# EAGLE design ldt1 (EAGLE 5.07)
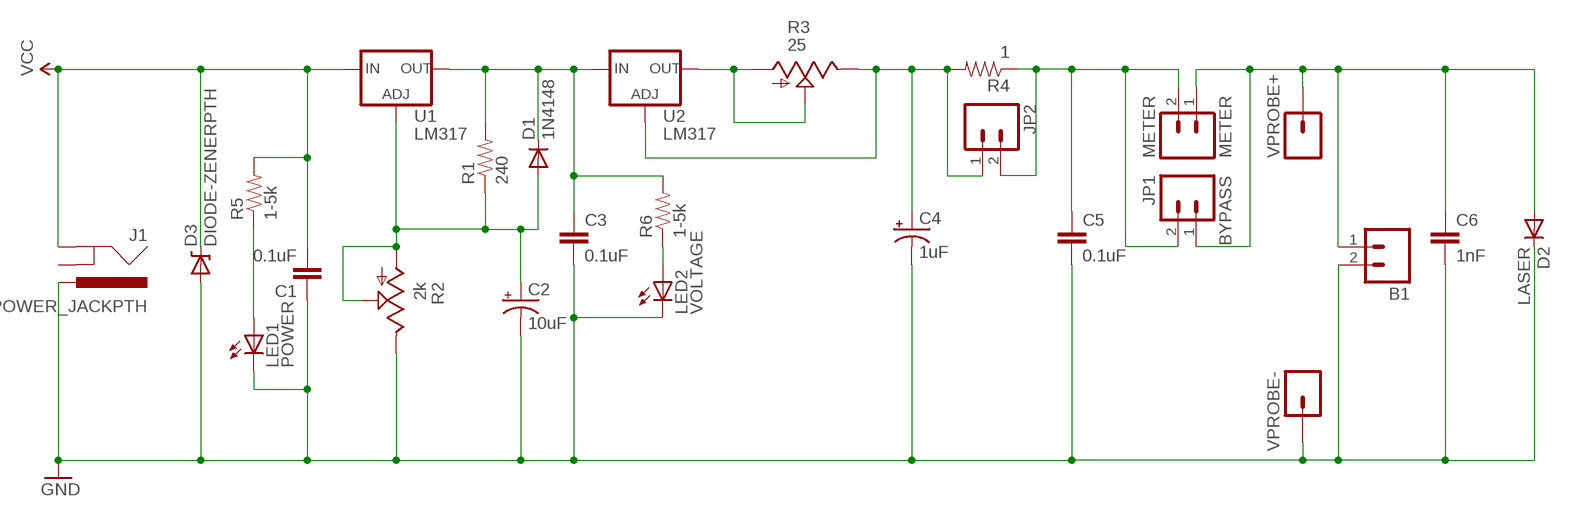
[diagram p0: schematic, sheet 1]

## Parts
B1  M02LOCK  [1X02_LOCK]
C1  0.1uF  CAPPTH2  [CAP-PTH-SMALL2]
C2  10uF  CAP_POLPTH2  [CPOL-RADIAL-10UF-25V]
C3  0.1uF  CAPPTH2  [CAP-PTH-SMALL2]
C4  1uF  CAP_POLPTH2  [CPOL-RADIAL-10UF-25V]
C5  0.1uF  CAPPTH2  [CAP-PTH-SMALL2]
C6  1nF  CAPPTH2  [CAP-PTH-SMALL2]
D1  1N4148  DIODE1N4148  [DIODE-1N4148]
D2  LASER  DIODE1N4148  [DIODE-1N4148]
D3  DIODE-ZENERPTH  [DIODE-ZENER]
J1  POWER_JACKPTH  [POWER_JACK_PTH]
JP1  BYPASS  M02LOCK  [1X02_LOCK]
JP2  M02LOCK  [1X02_LOCK]
LED1  POWER  LED3MM  [LED3MM]
LED2  VOLTAGE  LED3MM  [LED3MM]
METER  METER  M02LOCK  [1X02_LOCK]
R1  240  RESISTORPTH1  [AXIAL-0.3]
R2  2k  TRIM_US-S75P  [S75P]
R3  25  TRIM_US-S75P  [S75P]
R4  1  RESISTORPTH1  [AXIAL-0.3]
R5  1-5k  RESISTORPTH1  [AXIAL-0.3]
R6  1-5k  RESISTORPTH1  [AXIAL-0.3]
U1  LM317  V_REG_317SINK  [TO220-ADJ]
U2  LM317  V_REG_317SINK  [TO220-ADJ]
VPROBE+  M01OFFSET  [1X01_OFFSET]
VPROBE-  M01OFFSET  [1X01_OFFSET]

## Nets
GND: B1.2 C1.1 C2.2(-) C3.2 C4.2(-) C5.2 C6.2 D2.C D3.P$2(A) J1.PWR LED1.K(C) LED2.K(C) R2.E VPROBE-.1
N$1: C3.1 D1.C R1.P$2 R6.P$2 U1.OUT U2.IN
N$2: C2.1(+) D1.A R1.P$1 R2.A R2.S U1.ADJ
N$3: R3.A R3.S U2.OUT
N$4: LED1.A R5.P$1
N$5: C4.1(+) JP2.1 R3.E R4.P$2 U2.ADJ
N$6: LED2.A R6.P$1
N$7: B1.1 C6.1 D2.A JP1.1 METER.1 VPROBE+.1
N$9: C5.1 JP1.2 JP2.2 METER.2 R4.P$1
VCC: C1.2 D3.P$1(C) J1.GND R5.P$2 U1.IN
Unconnected: J1.GNDBREAK

## Library data of the parts
B1 JP1 JP2 METER = SparkFun:M02: Header 2 Standard 2-pin 0.1" header. Use with straight break away headers (SKU : PRT-00116), right angle break away headers (PRT-00553), swiss pins (PRT-00743), machine pins (PRT-00117), and female headers (PRT-00115). Molex polarized connector foot print use with SKU : PRT-08233 with associated crimp pins and housings.
C1 C3 C5 C6 = SparkFun:CAP: Capacitor Standard 0603 ceramic capacitor, and 0.1" leaded capacitor.
C2 C4 = SparkFun:CAP_POL: Capacitor Polarized These are standard SMD and PTH capacitors. Normally 10uF, 47uF, and 100uF in electrolytic and tantalum varieties. Always verify the external diameter of the through hole cap, it varies with capacity, voltage, and manufacturer. The EIA devices should be standard.
D1 D2 = SparkFun:DIODE: Diode These are standard reverse protection diodes and small signal diodes. SMA package can handle up to about 1A. SOD-323 can handle about 200mA. What the SOD-323 package when ordering, there are some mfgs out there that are 5-pin packages.
D3 = SparkFun:DIODE-ZENER: Zener Diode Production Part - 8199 3.4V Zener Voltage
J1 = SparkFun:POWER_JACK: Power Jack This is the standard 5.5mm barrel jack for power. The PTH is the most common, proven, reliable, footprint. All others are experimental. The Slot footprint only works if the mill layer is transmitted to the PCB fab house so be warned. Spark Fun Electronics SKU : PRT-00119. Mating wall wart : TOL-00298 (and others)
LED1 LED2 = SparkFun:LED: LEDs Standard schematic elements and footprints for 5mm, 3mm, 1206, and 0603 sized LEDs. 5mm - Spark Fun Electronics SKU : COM-00529 (and others)
R1 R4-R6 = SparkFun:RESISTOR: Resistor Basic schematic elements and footprints for 0603, 1206, and PTH 1/10th watt (small) resistors.
R2 R3 = pot:TRIM_US-: POTENTIOMETER
U1 U2 = SparkFun:V_REG_317: Voltage Regulator Standard LM317 adjustable voltage regulator. AOI (Adjust Output Input). Google 'LM317 Calculator' for easy to use app to get the two resistor values needed. 240/720 for 5V output. 240/390 for 3.3V output. Spark Fun Electronics SKU : COM-00527
VPROBE+ VPROBE- = SparkFun:M01: Header 1 Standard 1-pin 0.1" header. Use with straight break away headers (SKU : PRT-00116), right angle break away headers (PRT-00553), swiss pins (PRT-00743), machine pins (PRT-00117), and female headers (PRT-00115).

## Net classes
0 default: width 1.27 mm, clearance 0.381 mm
1 power: width 1.27 mm, clearance 0.381 mm

## Board
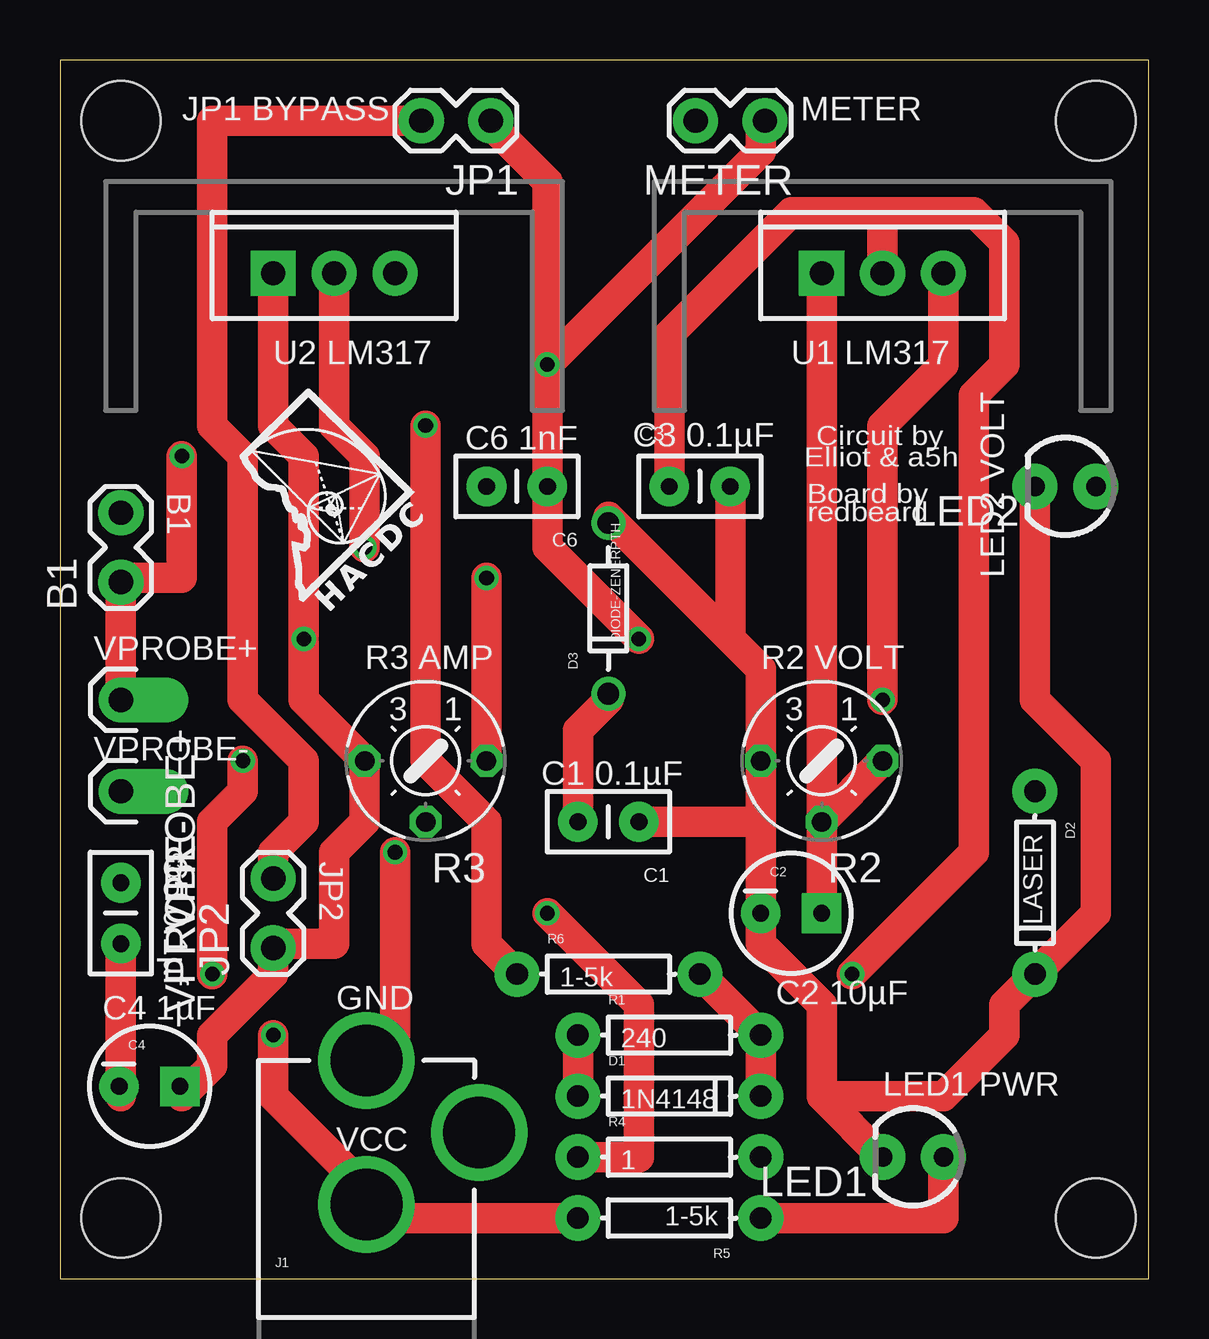
[diagram p1: board, top side]
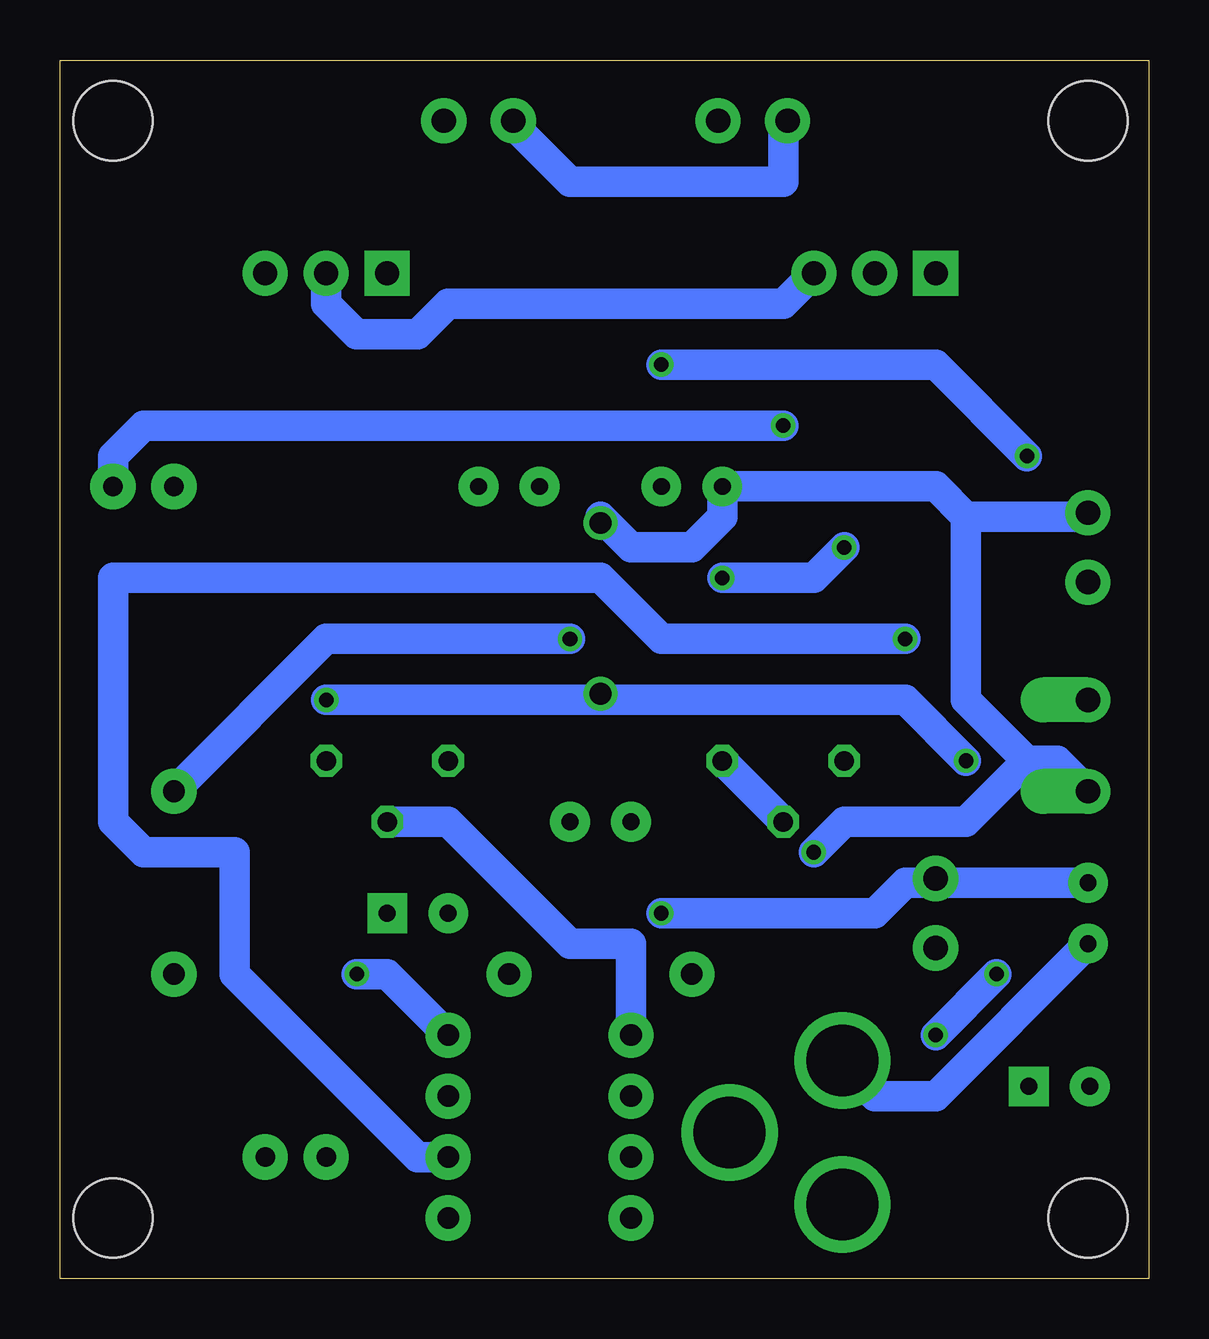
[diagram p2: board, bottom side, seen from below]

Size 45.39 x 50.79 mm. Coordinates in mm from the lower left corner, seen from the top.
Outline: 0,0 45.39,0 45.39,50.79 0,50.79 0,0
Copper layers (1*16): Top 0.035mm / dielectric 1.5mm / Bottom 0.035mm
Design rules "default *": minimum track width 12mil, minimum drill 24mil, track to track 12mil, track to pad 12mil, pad to pad 12mil, via to via 12mil, smd to smd 8mil, copper to edge 40mil, drill to drill 8mil, minimum pad ring 10mil, minimum via ring 8mil, stop-mask expansion 4mil, vias tented up to drill 0mil, thermal gap 10mil

### Footprints (pad centres in the part's own frame; a part is rotated, then mirrored left to right if it is on the bottom)
1X02_LOCK = drill 1.016 pad 1.88 round: 1 -0.178,0; 2 2.718,0
CAP-PTH-SMALL2 = drill 0.7 pad 1.651 round: 1 0,0; 2 2.54,0
CPOL-RADIAL-10UF-25V = drill 0.7 pad 1.651 square: 1 1.27,0 | drill 0.7 pad 1.651 round: 2 -1.27,0
DIODE-1N4148 = drill 0.9 pad 1.88 round: A -3.81,0; C 3.81,0
DIODE-ZENER = drill 0.9 round: P$1 -3.556,0; P$2 3.556,0
POWER_JACK_PTH = drill 2.997 round: GND 0,7.7; GNDBREAK 4.7,10.7; PWR 0,13.7
LED3MM = drill 0.813 pad 1.88 round: A -1.27,0; K 1.27,0
AXIAL-0.3 = drill 0.9 pad 1.88 round: P$1 -3.81,0; P$2 3.81,0
S75P = drill 0.813 octagon: A -2.54,0; E 2.54,0; S 0,2.54
TO220-ADJ = drill 1 pad 1.88 square: ADJ -2.54,0 | drill 1 pad 1.88 round: IN 2.54,0; OUT 0,0
STAND-OFF = hole 3.302: 0,0
1X01_OFFSET = drill 1.016 pad 1.88 offset: 1 0,0

### Placement (x,y rotation side)
B1  2.54,29.21 90 top
C1  24.13,19.05 180 top
C2  30.48,15.24 0 top
C3  25.4,33.02 0 top
C4  3.73,8.03 0 top
C5  2.54,16.51 270 top
C6  20.32,33.02 180 top
D1  25.4,7.62 0 top
D2  40.64,16.51 270 top
D3  22.86,27.94 90 top
J1  12.78,-4.6 0 top
JP1  17.78,48.26 180 top
JP2  8.89,13.97 90 top
LED1  35.56,5.08 180 top
LED2  41.91,33.02 180 top
METER  29.21,48.26 180 top
R1  25.4,10.16 0 top
R2  31.75,21.59 180 top
R3  15.24,21.59 180 top
R4  25.4,5.08 0 top
R5  25.4,2.54 180 top
R6  22.86,12.7 0 top
U1  34.29,41.91 0 top
U2  11.43,41.91 0 top
U$1  [STAND-OFF]  2.54,48.26 0 top
U$2  [STAND-OFF]  43.18,48.26 0 top
U$3  [STAND-OFF]  2.54,2.54 0 top
U$4  [STAND-OFF]  43.18,2.54 0 top
VPROBE+  2.54,24.13 270 top
VPROBE-  2.54,20.32 270 top

### Tracks (layer width: path | path; a pad name or v marks a point on that pad's centre or on a via)
GND  (via drill 0.61)
  Top 1.27: C5.2 2.54,7.62 C4.2 | 29.21,19.05 C2.2 29.21,13.97 31.75,11.43 31.75,7.62 | 29.21,19.05 R2.E 29.21,25.4 27.94,26.67 | 27.94,26.67 22.86,31.75 D3.P$2 | 29.21,19.05 C1.1 | 27.94,26.67 C3.2 | 31.75,7.62 LED1.K | 31.75,7.62 36.83,7.62 39.37,10.16 39.37,11.43 D2.C 43.18,15.24 43.18,21.59 40.64,24.13 LED2.K | v13.97,17.78 13.97,10.16 J1.PWR
  Bottom 1.27: C5.2 8.89,7.62 11.43,7.62 12.7,8.89 J1.PWR | VPROBE-.1 3.81,21.59 5.08,21.59 | 5.08,21.59 7.62,24.13 7.62,31.75 | 7.62,31.75 2.54,31.75 B1.2 | D3.P$2 22.86,31.75 21.59,30.48 19.05,30.48 17.78,31.75 C6.2 8.89,33.02 7.62,31.75 | v13.97,17.78 12.7,19.05 7.62,19.05 5.08,21.59
N$1  (via drill 0.61)
  Top 1.27: D1.C R1.P$2 R6.P$2 | C3.1 25.4,39.37 30.48,44.45 34.29,44.45 | 34.29,44.45 U1.OUT | v33.02,12.7 38.1,17.78 38.1,36.83 39.37,38.1 39.37,43.18 38.1,44.45 34.29,44.45
  Bottom 1.27: U2.IN 15.24,40.64 29.21,40.64 30.48,39.37 33.02,39.37 34.29,40.64 U1.OUT | R1.P$2 31.75,12.7 v33.02,12.7
N$2
  Top 1.27: D1.A R1.P$1 | R2.S R2.A | R2.S C2.1 | R2.S U1.ADJ
  Bottom 1.27: R1.P$1 21.59,13.97 24.13,13.97 29.21,19.05 R2.S
N$3  (via drill 0.61)
  Top 1.27: U2.OUT 11.43,35.56 12.7,34.29 v12.7,30.48 | R3.A v17.78,29.21
  Bottom 1.27: R3.S R3.A | v12.7,30.48 13.97,29.21 v17.78,29.21
N$4
  Top 1.27: R5.P$1 36.83,2.54 LED1.A
N$5  (via drill 0.61)
  Top 1.27: C4.1 5.08,7.62 6.35,8.89 6.35,10.16 8.89,12.7 JP2.1 8.89,13.97 11.43,13.97 11.43,17.78 12.7,19.05 R3.E 10.16,24.13 v10.16,26.67 10.16,34.29 8.89,35.56 U2.ADJ
  Bottom 1.27: R4.P$2 30.48,5.08 38.1,12.7 38.1,17.78 41.91,17.78 43.18,19.05 43.18,29.21 22.86,29.21 20.32,26.67 v10.16,26.67
N$6  (via drill 0.61)
  Top 1.27: R6.P$1 17.78,13.97 17.78,19.05 15.24,21.59 v15.24,35.56
  Bottom 1.27: v15.24,35.56 41.91,35.56 43.18,34.29 LED2.A
N$7  (via drill 0.61)
  Top 1.27: VPROBE+.1 B1.1 2.54,29.21 5.08,29.21 v5.08,34.29 | v20.32,38.1 20.32,45.72 17.78,48.26 JP1.1 | v20.32,38.1 C6.1 20.32,30.48 v24.13,26.67 | v20.32,38.1 29.21,46.99 29.21,48.26 METER.1
  Bottom 1.27: D2.A 34.29,26.67 v24.13,26.67 | v5.08,34.29 8.89,38.1 v20.32,38.1
N$9  (via drill 0.61)
  Top 1.27: R4.P$1 24.13,5.08 24.13,11.43 v20.32,15.24 | 15.24,48.26 JP1.2 6.35,48.26 6.35,35.56 7.62,34.29 7.62,24.13 10.16,21.59 10.16,19.05 8.89,17.78 JP2.2 8.89,16.51
  Bottom 1.27: JP1.2 15.24,48.26 15.24,45.72 24.13,45.72 26.67,48.26 METER.2 | C5.1 8.89,16.51 | v20.32,15.24 11.43,15.24 10.16,16.51 8.89,16.51 | 8.89,16.51 JP2.2
VCC  (via drill 0.61)
  Top 1.27: R5.P$2 13.97,2.54 J1.GND 12.7,3.81 8.89,7.62 v8.89,10.16 | C1.2 21.59,22.86 22.86,24.13 D3.P$1 | U1.IN 36.83,38.1 34.29,35.56 v34.29,24.13 | v6.35,12.7 6.35,19.05 7.62,20.32 v7.62,21.59
  Bottom 1.27: 22.86,24.13 v34.29,24.13 | v8.89,10.16 v6.35,12.7 | v7.62,21.59 10.16,24.13 22.86,24.13 | 22.86,24.13 D3.P$1

### Text on the board
tPlace: JP1 BYPASS | METER | U2 LM317 | U1 LM317 | Circuit by | C6 1nF | C3 0.1µF | Elliot & a5h | B1 | Board by | redbeard | LED2 VOLT | VPROBE+ | R3 AMP | R2 VOLT | VPROBE- | C1 0.1µF | C5 0.1µf | JP2 | C4 1µF | GND | C2 10µF | LED1 PWR | VCC